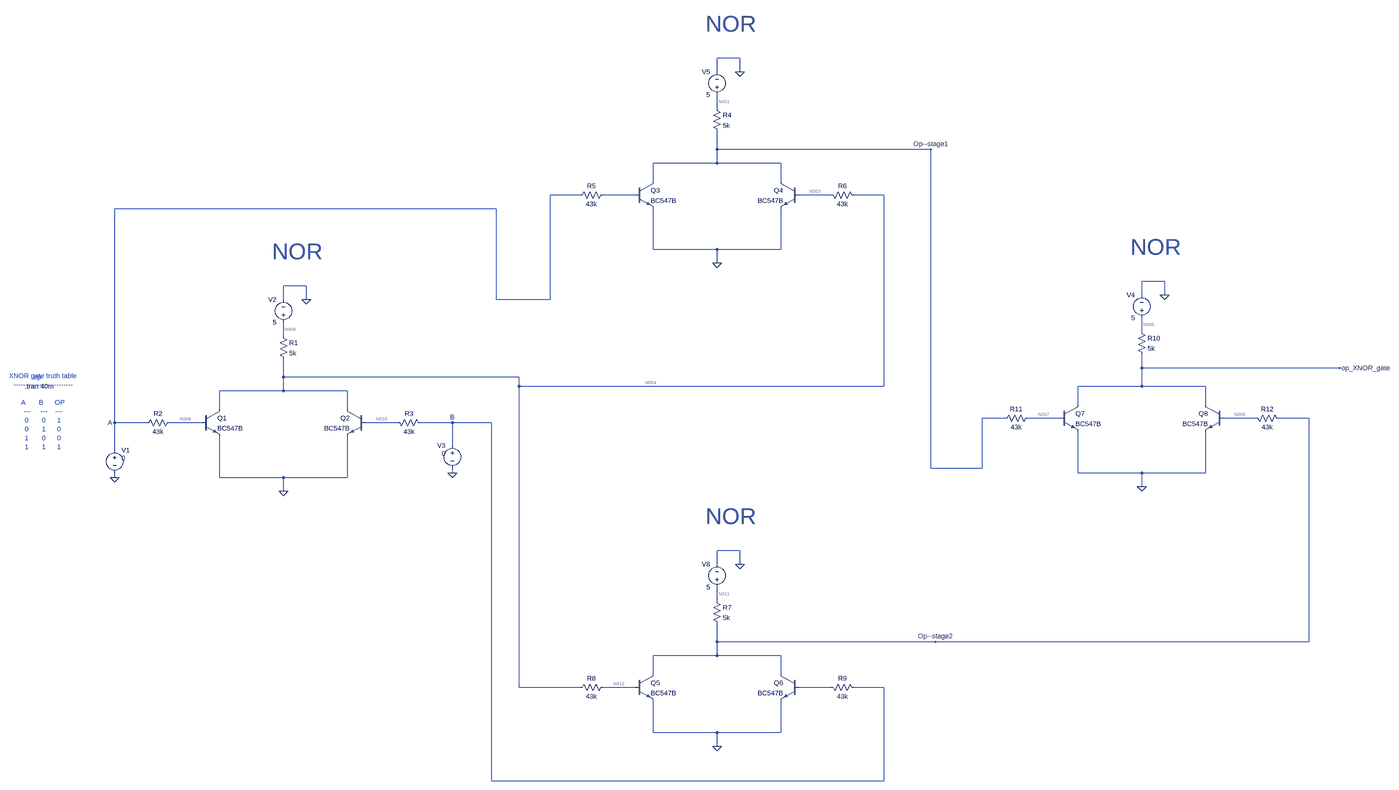
[diagram p0: schematic XNOR_using_NOR_gate.asc, whole sheet]
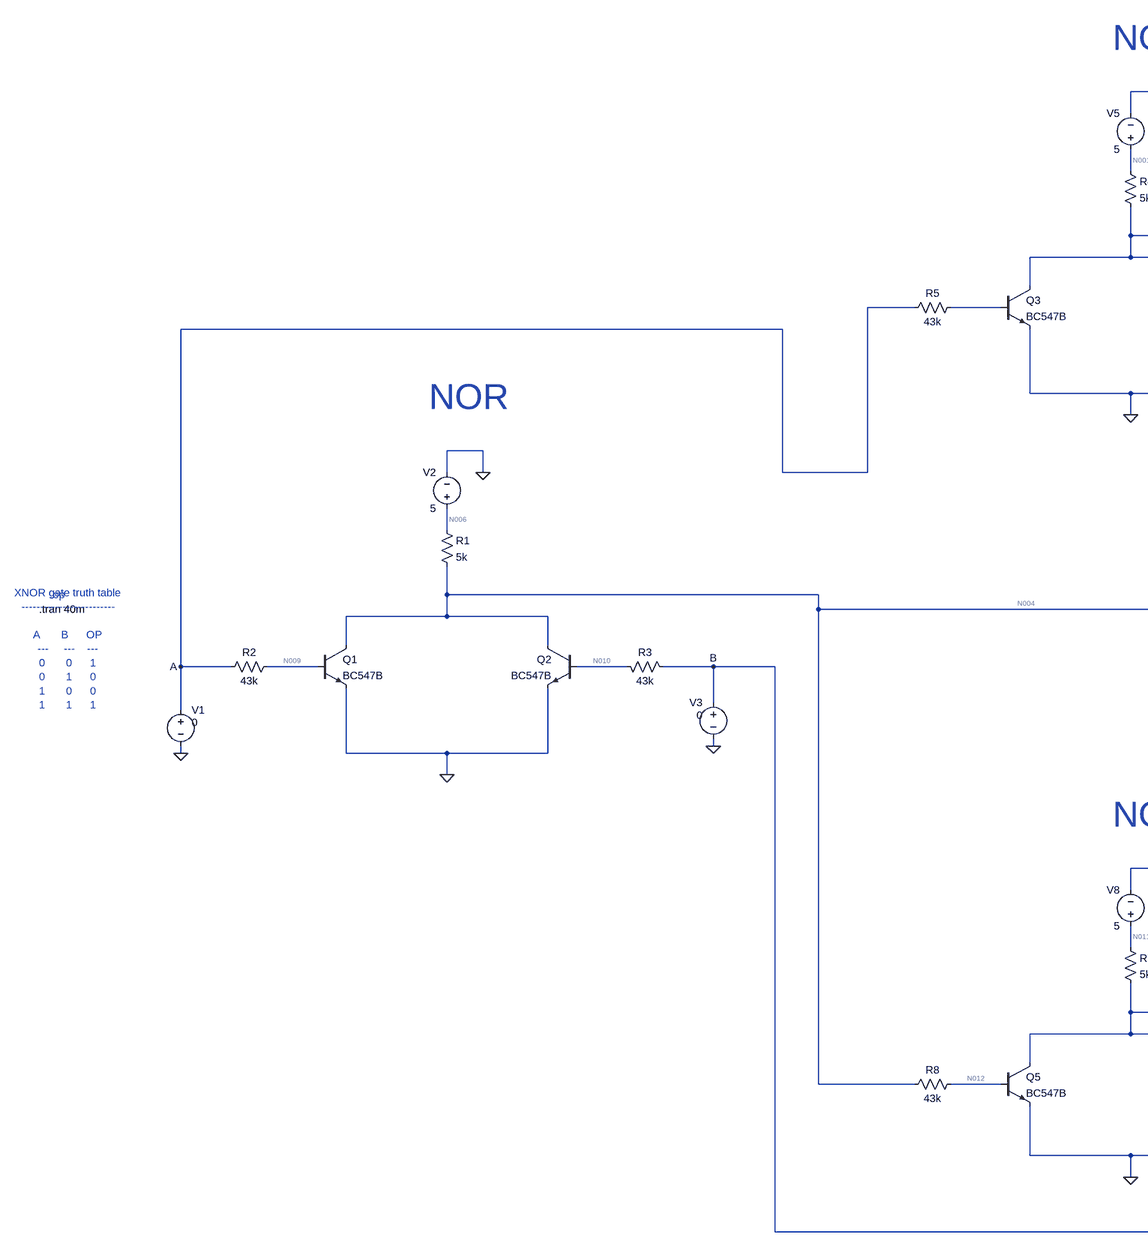
[diagram p1: schematic XNOR_using_NOR_gate.asc, part, row 1 of 1, column 1 of 2]
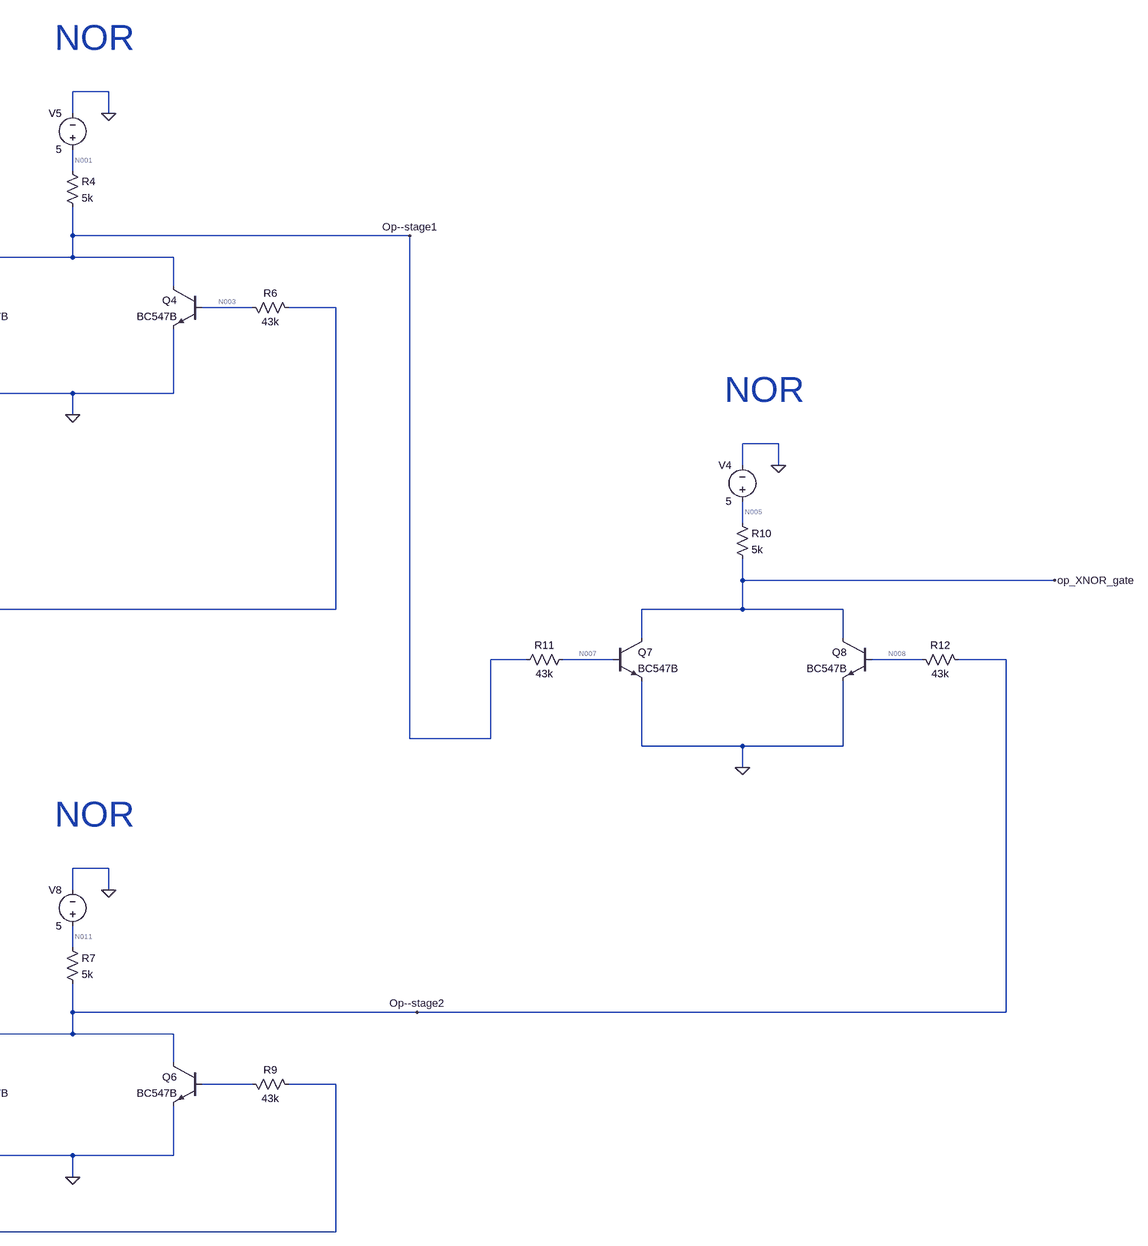
[diagram p2: schematic XNOR_using_NOR_gate.asc, part, row 1 of 1, column 2 of 2]
XNOR_using_NOR_gate.asc, the LTspice schematic file:
Version 4.1
SHEET 1 7112 1620
WIRE 2320 -1072 2240 -1072
WIRE 2240 -1024 2240 -1072
WIRE 2320 -1024 2320 -1072
WIRE 2240 -896 2240 -944
WIRE 2240 -752 2240 -816
WIRE 3056 -752 2240 -752
WIRE 2240 -704 2240 -752
WIRE 2240 -704 2016 -704
WIRE 2464 -704 2240 -704
WIRE 2016 -640 2016 -704
WIRE 2464 -640 2464 -704
WIRE 1760 -592 1600 -592
WIRE 1952 -592 1840 -592
WIRE 2640 -592 2528 -592
WIRE 2832 -592 2720 -592
WIRE 1104 -544 -240 -544
WIRE 2016 -400 2016 -544
WIRE 2240 -400 2016 -400
WIRE 2464 -400 2464 -544
WIRE 2464 -400 2240 -400
WIRE 2240 -352 2240 -400
WIRE 3904 -288 3824 -288
WIRE 432 -272 352 -272
WIRE 3824 -240 3824 -288
WIRE 3904 -240 3904 -288
WIRE 352 -224 352 -272
WIRE 432 -224 432 -272
WIRE 1104 -224 1104 -544
WIRE 1600 -224 1600 -592
WIRE 1600 -224 1104 -224
WIRE 3824 -112 3824 -160
WIRE 352 -96 352 -144
WIRE 3824 16 3824 -32
WIRE 5008 16 3824 16
WIRE 352 48 352 -16
WIRE 1184 48 352 48
WIRE 1184 80 1184 48
WIRE 2832 80 2832 -592
WIRE 2832 80 1184 80
WIRE 3824 80 3824 16
WIRE 3824 80 3600 80
WIRE 4048 80 3824 80
WIRE 352 96 352 48
WIRE 352 96 128 96
WIRE 576 96 352 96
WIRE 3600 144 3600 80
WIRE 4048 144 4048 80
WIRE 128 160 128 96
WIRE 576 160 576 96
WIRE 3344 192 3264 192
WIRE 3536 192 3424 192
WIRE 4224 192 4112 192
WIRE 4560 192 4304 192
WIRE -240 208 -240 -544
WIRE -128 208 -240 208
WIRE 64 208 -48 208
WIRE 752 208 640 208
WIRE 944 208 832 208
WIRE 1088 208 944 208
WIRE 944 288 944 208
WIRE -240 304 -240 208
WIRE 3056 368 3056 -752
WIRE 3264 368 3264 192
WIRE 3264 368 3056 368
WIRE 944 384 944 368
WIRE 3600 384 3600 240
WIRE 3824 384 3600 384
WIRE 4048 384 4048 240
WIRE 4048 384 3824 384
WIRE -240 400 -240 384
WIRE 128 400 128 256
WIRE 352 400 128 400
WIRE 576 400 576 256
WIRE 576 400 352 400
WIRE 3824 432 3824 384
WIRE 352 448 352 400
WIRE 2320 656 2240 656
WIRE 2240 704 2240 656
WIRE 2320 704 2320 656
WIRE 2240 832 2240 784
WIRE 2240 976 2240 912
WIRE 3072 976 2240 976
WIRE 4560 976 4560 192
WIRE 4560 976 3072 976
WIRE 2240 1024 2240 976
WIRE 2240 1024 2016 1024
WIRE 2464 1024 2240 1024
WIRE 2016 1088 2016 1024
WIRE 2464 1088 2464 1024
WIRE 1184 1136 1184 80
WIRE 1760 1136 1184 1136
WIRE 1952 1136 1840 1136
WIRE 2640 1136 2528 1136
WIRE 2832 1136 2720 1136
WIRE 2016 1328 2016 1184
WIRE 2240 1328 2016 1328
WIRE 2464 1328 2464 1184
WIRE 2464 1328 2240 1328
WIRE 2240 1376 2240 1328
WIRE 1088 1616 1088 208
WIRE 2832 1616 2832 1136
WIRE 2832 1616 1088 1616
FLAG -240 208 A
FLAG -240 400 0
FLAG 944 208 B
FLAG 352 448 0
FLAG 432 -224 0
FLAG 944 384 0
FLAG 2240 -352 0
FLAG 2320 -1024 0
FLAG 3056 -752 Op--stage1
FLAG 2240 1376 0
FLAG 2320 704 0
FLAG 3072 976 Op--stage2
FLAG 3824 432 0
FLAG 3904 -240 0
FLAG 5008 16 op_XNOR_gate
SYMBOL voltage -240 288 R0
WINDOW 3 24 44 Left 2
WINDOW 123 0 0 Left 0
WINDOW 39 0 0 Left 0
SYMATTR Value 0
SYMATTR InstName V1
SYMBOL npn 64 160 R0
SYMATTR InstName Q1
SYMATTR Value BC547B
SYMBOL voltage 352 -128 R180
WINDOW 0 24 96 Left 2
WINDOW 3 24 16 Left 2
WINDOW 123 0 0 Left 0
WINDOW 39 0 0 Left 0
SYMATTR InstName V2
SYMATTR Value 5
SYMBOL res 336 -112 R0
SYMATTR InstName R1
SYMATTR Value 5k
SYMBOL res -32 192 R90
WINDOW 0 0 56 VBottom 2
WINDOW 3 32 56 VTop 2
SYMATTR InstName R2
SYMATTR Value 43k
SYMBOL npn 640 160 M0
SYMATTR InstName Q2
SYMATTR Value BC547B
SYMBOL res 736 192 M90
WINDOW 0 0 56 VBottom 2
WINDOW 3 32 56 VTop 2
SYMATTR InstName R3
SYMATTR Value 43k
SYMBOL voltage 944 272 M0
WINDOW 3 24 44 Left 2
WINDOW 123 0 0 Left 0
WINDOW 39 0 0 Left 0
SYMATTR Value 0
SYMATTR InstName V3
SYMBOL npn 1952 -640 R0
SYMATTR InstName Q3
SYMATTR Value BC547B
SYMBOL voltage 2240 -928 R180
WINDOW 0 24 96 Left 2
WINDOW 3 24 16 Left 2
WINDOW 123 0 0 Left 0
WINDOW 39 0 0 Left 0
SYMATTR InstName V5
SYMATTR Value 5
SYMBOL res 2224 -912 R0
SYMATTR InstName R4
SYMATTR Value 5k
SYMBOL res 1856 -608 R90
WINDOW 0 0 56 VBottom 2
WINDOW 3 32 56 VTop 2
SYMATTR InstName R5
SYMATTR Value 43k
SYMBOL npn 2528 -640 M0
SYMATTR InstName Q4
SYMATTR Value BC547B
SYMBOL res 2624 -608 M90
WINDOW 0 0 56 VBottom 2
WINDOW 3 32 56 VTop 2
SYMATTR InstName R6
SYMATTR Value 43k
SYMBOL npn 1952 1088 R0
SYMATTR InstName Q5
SYMATTR Value BC547B
SYMBOL voltage 2240 800 R180
WINDOW 0 24 96 Left 2
WINDOW 3 24 16 Left 2
WINDOW 123 0 0 Left 0
WINDOW 39 0 0 Left 0
SYMATTR InstName V8
SYMATTR Value 5
SYMBOL res 2224 816 R0
SYMATTR InstName R7
SYMATTR Value 5k
SYMBOL res 1856 1120 R90
WINDOW 0 0 56 VBottom 2
WINDOW 3 32 56 VTop 2
SYMATTR InstName R8
SYMATTR Value 43k
SYMBOL npn 2528 1088 M0
SYMATTR InstName Q6
SYMATTR Value BC547B
SYMBOL res 2624 1120 M90
WINDOW 0 0 56 VBottom 2
WINDOW 3 32 56 VTop 2
SYMATTR InstName R9
SYMATTR Value 43k
SYMBOL npn 3536 144 R0
SYMATTR InstName Q7
SYMATTR Value BC547B
SYMBOL voltage 3824 -144 R180
WINDOW 0 24 96 Left 2
WINDOW 3 24 16 Left 2
WINDOW 123 0 0 Left 0
WINDOW 39 0 0 Left 0
SYMATTR InstName V4
SYMATTR Value 5
SYMBOL res 3808 -128 R0
SYMATTR InstName R10
SYMATTR Value 5k
SYMBOL res 3440 176 R90
WINDOW 0 0 56 VBottom 2
WINDOW 3 32 56 VTop 2
SYMATTR InstName R11
SYMATTR Value 43k
SYMBOL npn 4112 144 M0
SYMATTR InstName Q8
SYMATTR Value BC547B
SYMBOL res 4208 176 M90
WINDOW 0 0 56 VBottom 2
WINDOW 3 32 56 VTop 2
SYMATTR InstName R12
SYMATTR Value 43k
TEXT -800 80 Left 2 !.tran 40m
TEXT -776 48 Left 2 ;.op
TEXT -736 168 Center 2 ;XNOR gate truth table\n-------------------------\n \nA       B      OP\n---     ---    ---\n0       0      1\n0       1      0\n1       0      0\n1       1      1
TEXT 312 -392 Left 6 ;NOR
TEXT 2200 -1192 Left 6 ;NOR
TEXT 2200 536 Left 6 ;NOR
TEXT 3784 -408 Left 6 ;NOR

The netlist it stands for:
* XNOR_using_NOR_gate.asc
V1 A 0 0
Q1 N004 N009 0 0 BC547B
V2 N006 0 5
R1 N006 N004 5k
R2 N009 A 43k
Q2 N004 N010 0 0 BC547B
R3 N010 B 43k
V3 B 0 0
Q3 Op--stage1 N002 0 0 BC547B
V5 N001 0 5
R4 N001 Op--stage1 5k
R5 N002 A 43k
Q4 Op--stage1 N003 0 0 BC547B
R6 N003 N004 43k
Q5 Op--stage2 N012 0 0 BC547B
V8 N011 0 5
R7 N011 Op--stage2 5k
R8 N012 N004 43k
Q6 Op--stage2 N013 0 0 BC547B
R9 N013 B 43k
Q7 op_XNOR_gate N007 0 0 BC547B
V4 N005 0 5
R10 N005 op_XNOR_gate 5k
R11 N007 Op--stage1 43k
Q8 op_XNOR_gate N008 0 0 BC547B
R12 N008 Op--stage2 43k
.model NPN NPN
.model PNP PNP
.lib standard.bjt
.tran 40m
* .op
* XNOR gate truth table
* -------------------------
* A       B      OP
* ---     ---    ---
* 0       0      1
* 0       1      0
* 1       0      0
* 1       1      1
* NOR
* NOR
* NOR
* NOR
.backanno
.end

* Results of the author's LTspice run, read from the files saved beside the schematic
* Operating Point, zero values left out:
*   V(n004) = 4.179 V
*   V(n006) = 5 V
*   V(n010) = 182.5 nV
*   V(op--stage1) = 34.56 mV
*   V(n003) = 650.9 mV
*   V(n012) = 650.9 mV
*   V(n011) = 5 V
*   V(op_xnor_gate) = 5 V
*   V(n008) = 34.56 mV
*   V(n009) = 182.5 nV
*   V(n001) = 5 V
*   V(op--stage2) = 34.56 mV
*   V(n007) = 34.56 mV
*   V(n005) = 5 V
*   I(V1) = 4.323 pA
*   I(R2) = 4.245 pA
*   Ic(Q2) = 4.271 pA
*   Ib(Q2) = -4.245 pA
*   I(R4) = 993.1 µA
*   I(R6) = -82.06 µA
*   Ic(Q7) = 5.128 pA
*   Ib(Q7) = -4.991 pA
*   I(V2) = -164.1 µA
*   I(V3) = 4.323 pA
*   Ic(Q4) = 993.1 µA
*   Ib(Q4) = 82.06 µA
*   Ie(Q4) = -1.075 mA
*   I(V8) = -993.1 µA
*   I(R11) = 4.991 pA
*   I(R12) = 4.991 pA
*   Ic(Q1) = 4.271 pA
*   Ib(Q1) = -4.245 pA
*   I(R3) = 4.245 pA
*   I(V5) = -993.1 µA
*   Ic(Q5) = 993.1 µA
*   Ib(Q5) = 82.06 µA
*   Ie(Q5) = -1.075 mA
*   I(R7) = 993.1 µA
*   I(R8) = -82.06 µA
*   I(R10) = 10.26 pA
*   I(R1) = 164.1 µA
*   I(V4) = -10.26 pA
*   Ic(Q8) = 5.128 pA
*   Ib(Q8) = -4.991 pA